# EasyEDA schematic SCH_DITO2_2026-01-28.json
TITLE: Sheet_1; REV: 1.0; Date: 2026-01-23; Sheet: 1/1; Drawn By: siudin22; Company: Your Company
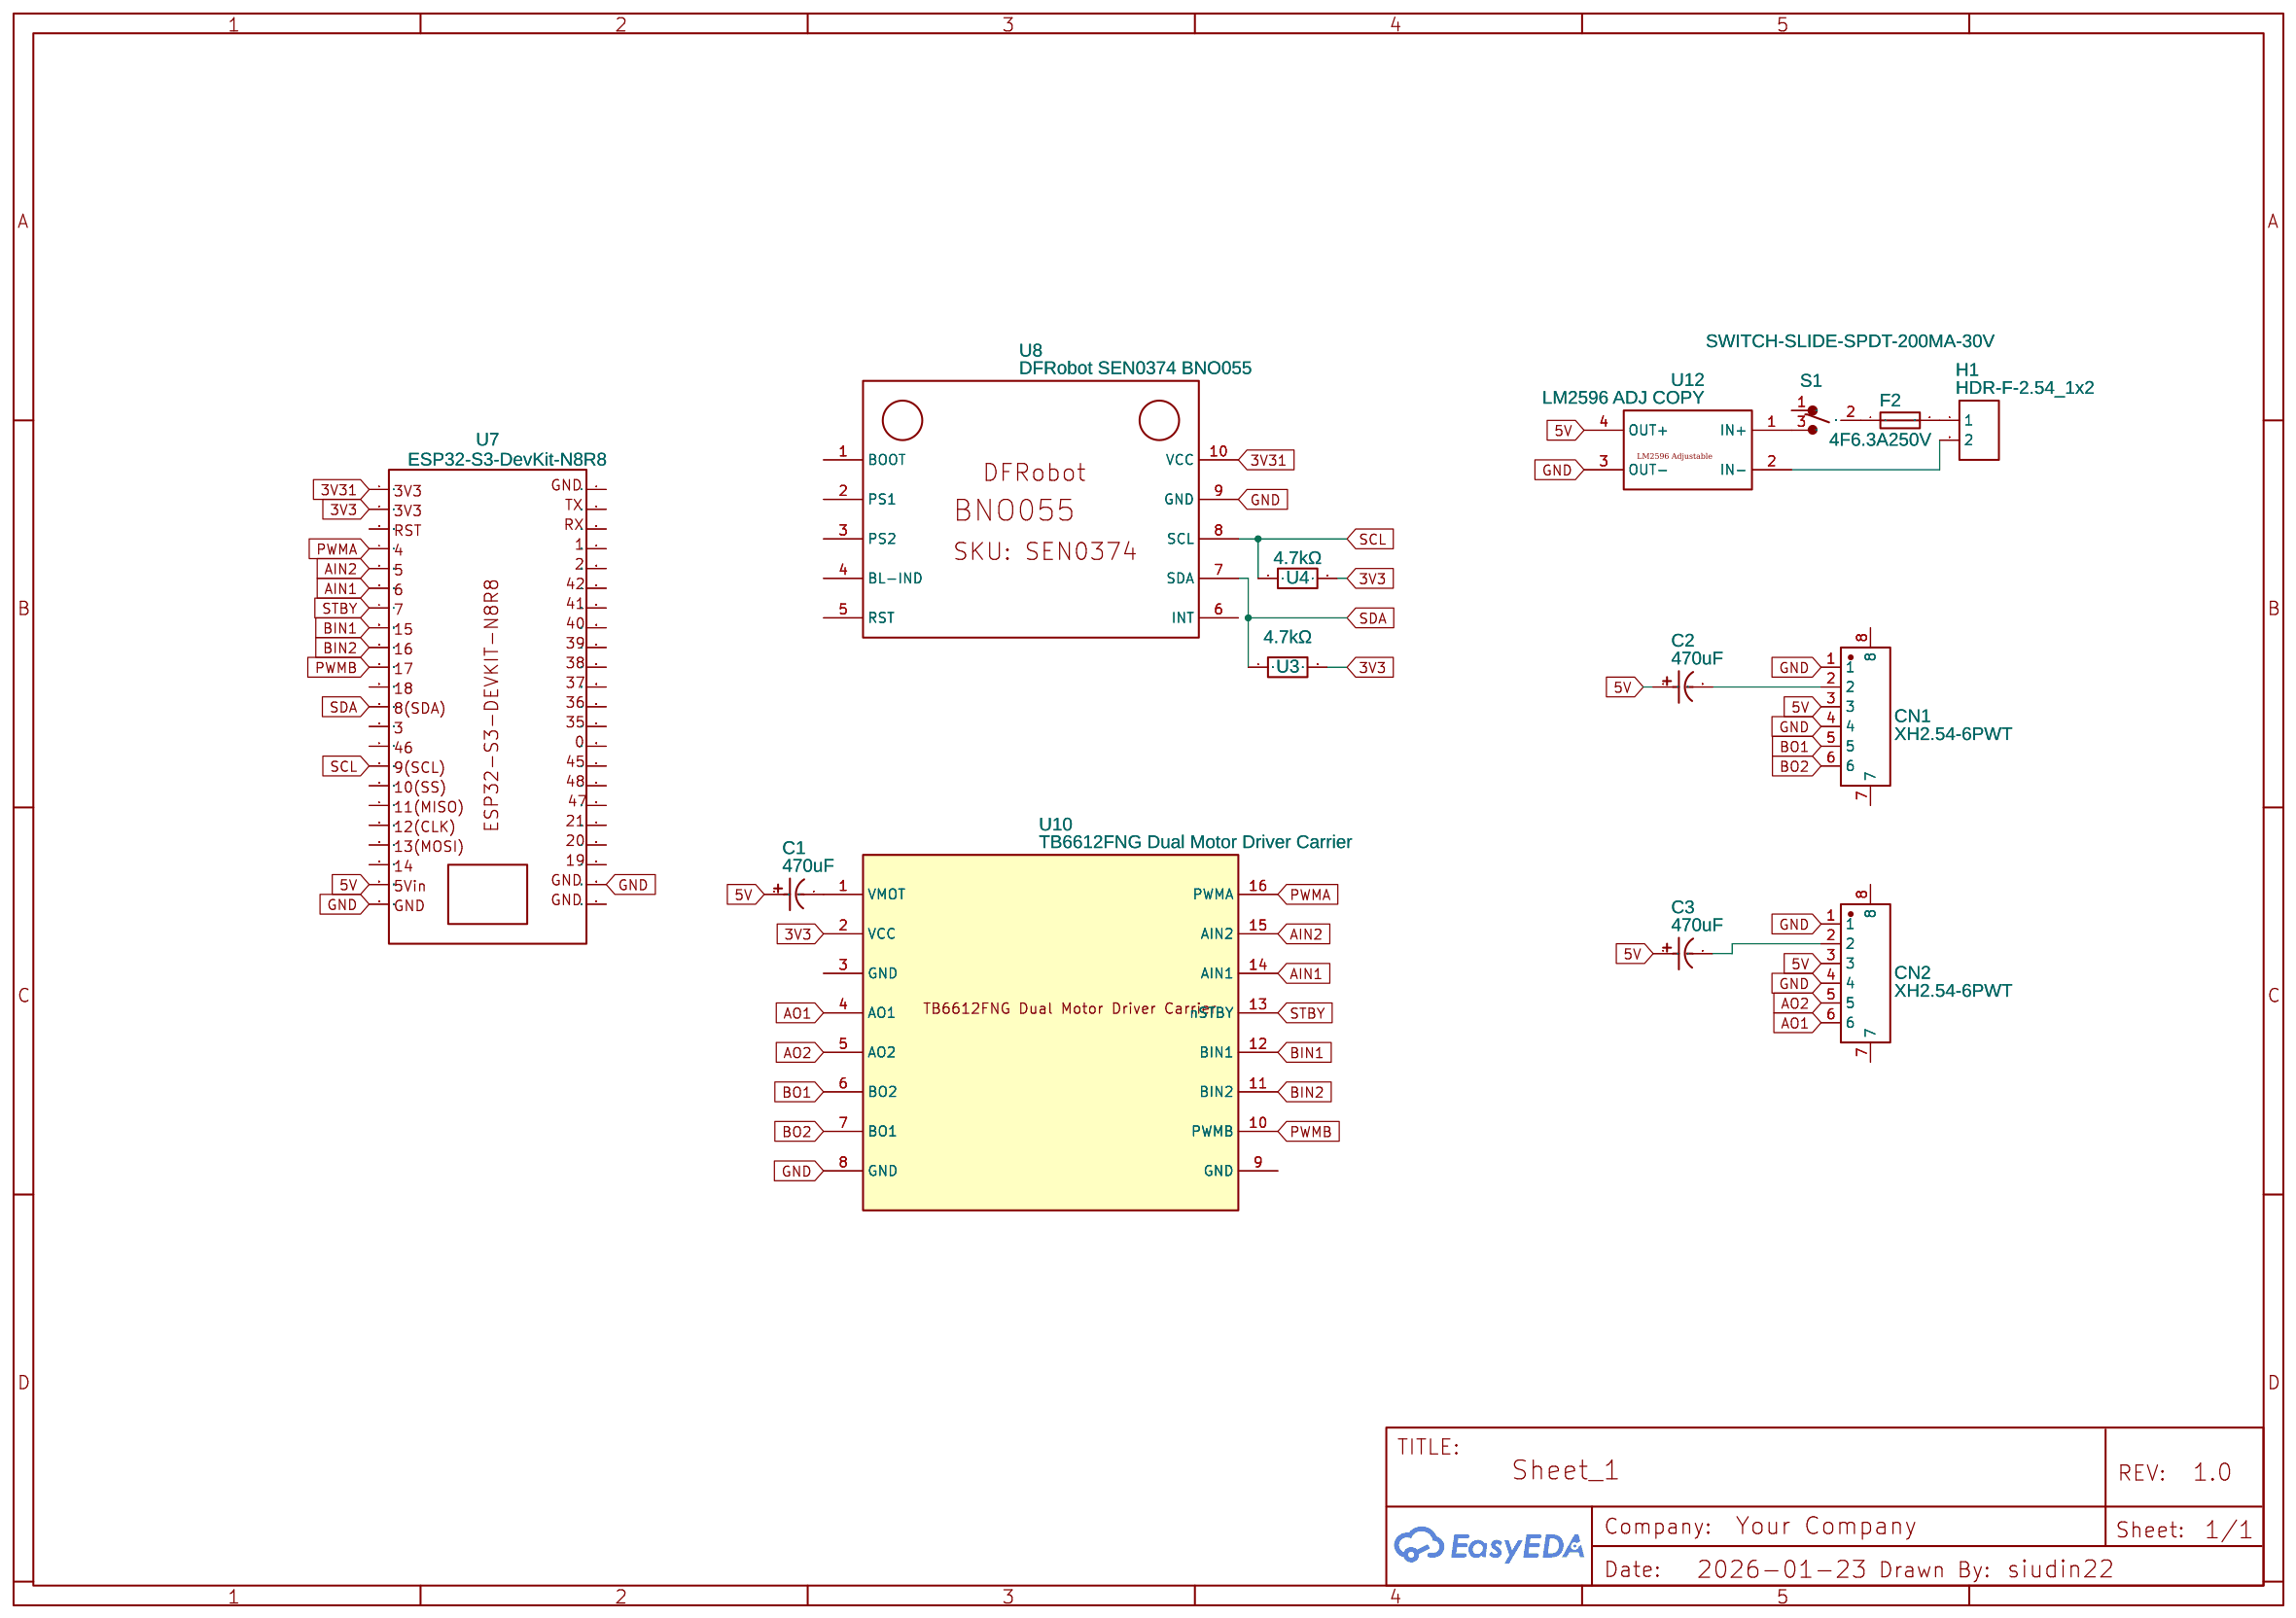
[diagram p0: schematic sheet]

## Parts
C1  470uF  [470UF CAPACITOR]
C2  470uF  [470UF CAPACITOR]
C3  470uF  [470UF CAPACITOR]
CN1  XH2.54-6PWT  [CONN-SMD_6P-P2.54_XH2.54-6PWT]
CN2  XH2.54-6PWT  [CONN-SMD_6P-P2.54_XH2.54-6PWT]
F2  4F6.3A250V  [FUSE-TH_BD4.0-L11.0-P15.00-D0.6]
H1  HDR-F-2.54_1x2  [HDR-F-2.54_1X2]
S1  SWITCH-SLIDE-SPDT-200MA-30V  [SWITCH-ESWITCH-SLIDE-TH-EG1218]
U3  4.7kΩ  [RES-TH_BD6.4-L16.0-P20.00-D1.0]
U4  4.7kΩ  [RES-TH_BD6.4-L16.0-P20.00-D1.0]
U7  ESP32-S3-DevKit-N8R8  [ESP32-S3-DEVKIT-N8R8]
U8  DFRobot SEN0374 BNO055  [FOOTPRINT DFROBOT SEN0374 BNO055]
U10  TB6612FNG Dual Motor Driver Carrier  [TB6612FNG]
U12  LM2596 ADJ COPY  [LM2596:YAAJ_DCDC_STEPDOWN_LM2596]

## Library data of the parts
C1-C3 = 470UF 25V 8X14: Supplier: LCSC; Manufacturer: ValuePro; Manufacturer Part: 470uF 25V 8*14; Supplier Part: C44592; Contributor: EP_Rofi Maytsa
CN1 CN2 = XH2.54-6PWT: Supplier: LCSC; Supplier Part: C52037462; Manufacturer: XUNPU(讯普); JLCPCB Part Class: Extended Part; Contributor: lcsc
F2 = 4F6.3A250V: Contributor: lcsc; Supplier: LCSC; Supplier Part: C2905522; Manufacturer: xcfuse(旭程); JLCPCB Part Class: Extended Part
H1 = HDR-F-2.54_1x2: Supplier Part: C49661; Supplier: LCSC; Contributor: LCEDA_Lib
S1 = SWITCH-SLIDE-SPDT-200MA-30V: Contributor: gokmenim
U3 U4 = B5J4K7E: Contributor: lcsc; Supplier: LCSC; Supplier Part: C3390491; Manufacturer: Ohmite; JLCPCB Part Class: Extended Part
U7 = ESP32-S3-DevKit-N8R8: Manufacturer: WaveShare; Supplier: Mouser; link: https://www.waveshare.com/wiki/ESP32-S3-DEV-KIT-N8R8; Contributor: robciog1968
U8 = DFRobot SEN0374 BNO055: Contributor: huynhquoctoan26
U10 = TB6612FNG Dual Motor Driver Carrier: Contributor: jazmin.trejo.p; sourceId: YsmgyP7pj; Mounted: Yes
U12 = BuckConverters_LM2596_Adj: Servo 5V; Add into BOM: yes; Convert to PCB: yes; Origin Footprint: YAAJ_DCDC_StepDown_LM2596; Contributor: ottello

## Nets
3V3: U3.2 U4.2 U7.2 U10.2(VCC)
3V31: U7.1 U8.10(VCC)
5V: C1.1 C2.1 C3.1 CN1.3 CN2.3 U7.21 U12.4(OUT+)
GND: CN1.1 CN1.4 CN2.1 CN2.4 U7.22 U7.24 U8.9(GND) U10.8(GND) U12.3(OUT-)
AIN1: U7.6 U10.14(AIN1)
AIN2: U7.5 U10.15(AIN2)
AO1: CN2.6 U10.4(AO1)
AO2: CN2.5 U10.5(AO2)
BIN1: U7.8 U10.12(BIN1)
BIN2: U7.9 U10.11(BIN2)
BO1: CN1.5 U10.6(BO2)
BO2: CN1.6 U10.7(BO1)
PWMA: U7.4 U10.16(PWMA)
PWMB: U7.10 U10.10(PWMB)
SCL: U4.1 U7.15 U8.8(SCL)
SDA: U3.1 U7.12 U8.7(SDA)
STBY: U7.7 U10.13(nSTBY)
Net-(C1-2): C1.2 U10.1(VMOT)
Net-(C2-2): C2.2 CN1.2
Net-(C3-2): C3.2 CN2.2
Net-(F2-1): F2.1 S1.2
Net-(F2-2): F2.2 H1.1
Net-(H1-2): H1.2 U12.2(IN-)
Net-(S1-3): S1.3 U12.1(IN+)

Not connected (* = marked no-connect by the designer): CN1 7 8; CN2 7 8; S1 1; U7 3 11 13 14 16 17 18 19 20 23 25 26 27 28 29 30 31 32 33 34 35 36 37 38 39 40 41 42 43 44; U8 1(BOOT) 2(PS1) 3(PS2) 4(BL-IND) 5(RST) 6(INT); U10 3(GND) 9(GND)
